# Altium schematic sheet E17-12-VCU-TPC.SchDoc
size A4
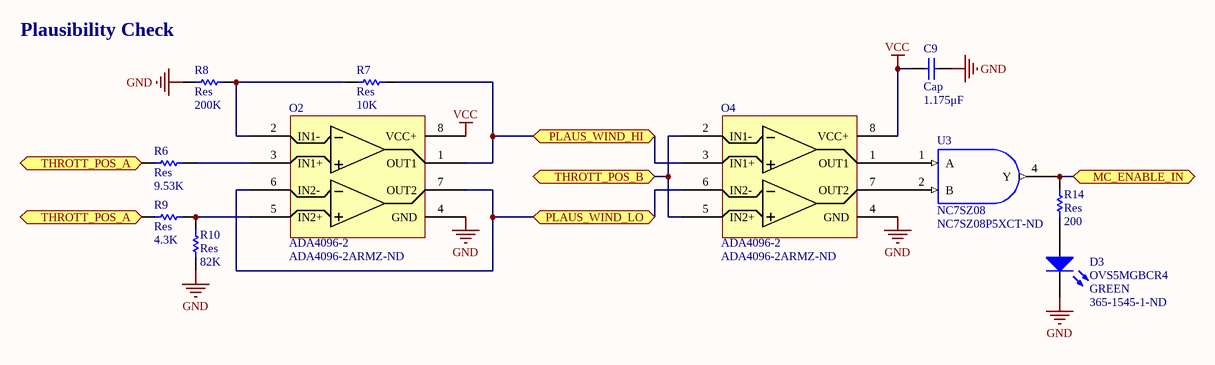
[diagram p0: E17-12-VCU-TPC.SchDoc]

## Parts
C9  Cap  value 1.175μF  [C0805]
D3  OVS5MGBCR4  Colour: GREEN  Supplier Part Number 1: 365-1545-1-ND  [OVS5MGBCR4]
O2  ADA4096-2  Supplier Part Number 1: ADA4096-2ARMZ-ND  [TSSOP8]
O4  ADA4096-2  Supplier Part Number 1: ADA4096-2ARMZ-ND  [TSSOP8]
R6  Res  value 9.53K  [2012[0805]]
R7  Res  value 10K  [2012[0805]]
R8  Res  value 200K  [2012[0805]]
R9  Res  value 4.3K  [2012[0805]]
R10  Res  value 82K  [2012[0805]]
R14  Res  value 200  [2012[0805]]
U3  NC7SZ08  Supplier Part Number 1: NC7SZ08P5XCT-ND  [SOT95P280X145-5N]

## Ports
MC_ENABLE_IN, PLAUS_WIND_HI, PLAUS_WIND_LO, THROTT_POS_A, THROTT_POS_B

## Nets
GND: C9.1 D3.2(K) O2.4(GND) O4.4(GND) R8.1 R10.1 U3.3(GND)
VCC: C9.2 O2.8(VCC+) O4.8(VCC+) U3.5(VCC)
MC_ENABLE_IN: R14.2 U3.4(Y) ; port MC_ENABLE_IN
PLAUS_WIND_HI: O2.1(OUT1) O4.3(IN1+) R7.2 ; port PLAUS_WIND_HI
PLAUS_WIND_LO: O2.6(IN2-) O2.7(OUT2) O4.6(IN2-) ; port PLAUS_WIND_LO
THROTT_POS_A: R6.2 R9.2 ; port THROTT_POS_A
THROTT_POS_B: O4.2(IN1-) O4.5(IN2+) ; port THROTT_POS_B
NetD3_1: D3.1(A) R14.1
NetO2_2: O2.2(IN1-) R7.1 R8.2
NetO2_3: O2.3(IN1+) R6.1
NetO2_5: O2.5(IN2+) R9.1 R10.2
NetO4_1: O4.1(OUT1) U3.1(A)
NetO4_7: O4.7(OUT2) U3.2(B)

## Notes on the sheet
- (near R8) Plausibility Check

## Library data of the parts
C9 = Cap: Capacitor; Published: 8-Jun-2000; LatestRevisionDate: 17-Jul-2002; LatestRevisionNote: Re-released for DXP Platform.; PackageReference: C1206; Publisher: Altium Limited
D3 = OVS5MGBCR4: Typical GREEN LED; Published: 8-Jun-2000; LatestRevisionDate: 17-Jul-2002; LatestRevisionNote: Re-released for DXP Platform.; PackageDocument: Feb-2002; PackageReference: 3.2X1.6X1.1; Publisher: Altium Limited; Supplier 1: Digi-Key
O2 O4 = ADA4096-2: 2 Op-Amps, 8-TSSOP, 32V Overvoltage Protection; Supplier 1: Digi-Key
R6-R10 R14 = Res: Surface Mount Resistor; Published: 8-Jun-2000; LatestRevisionDate: 17-Jul-2002; LatestRevisionNote: Re-released for DXP Platform.; PackageReference: AXIAL-0.5; Publisher: Altium Limited
U3 = NC7SZ08: Supplier 1: Digi-Key